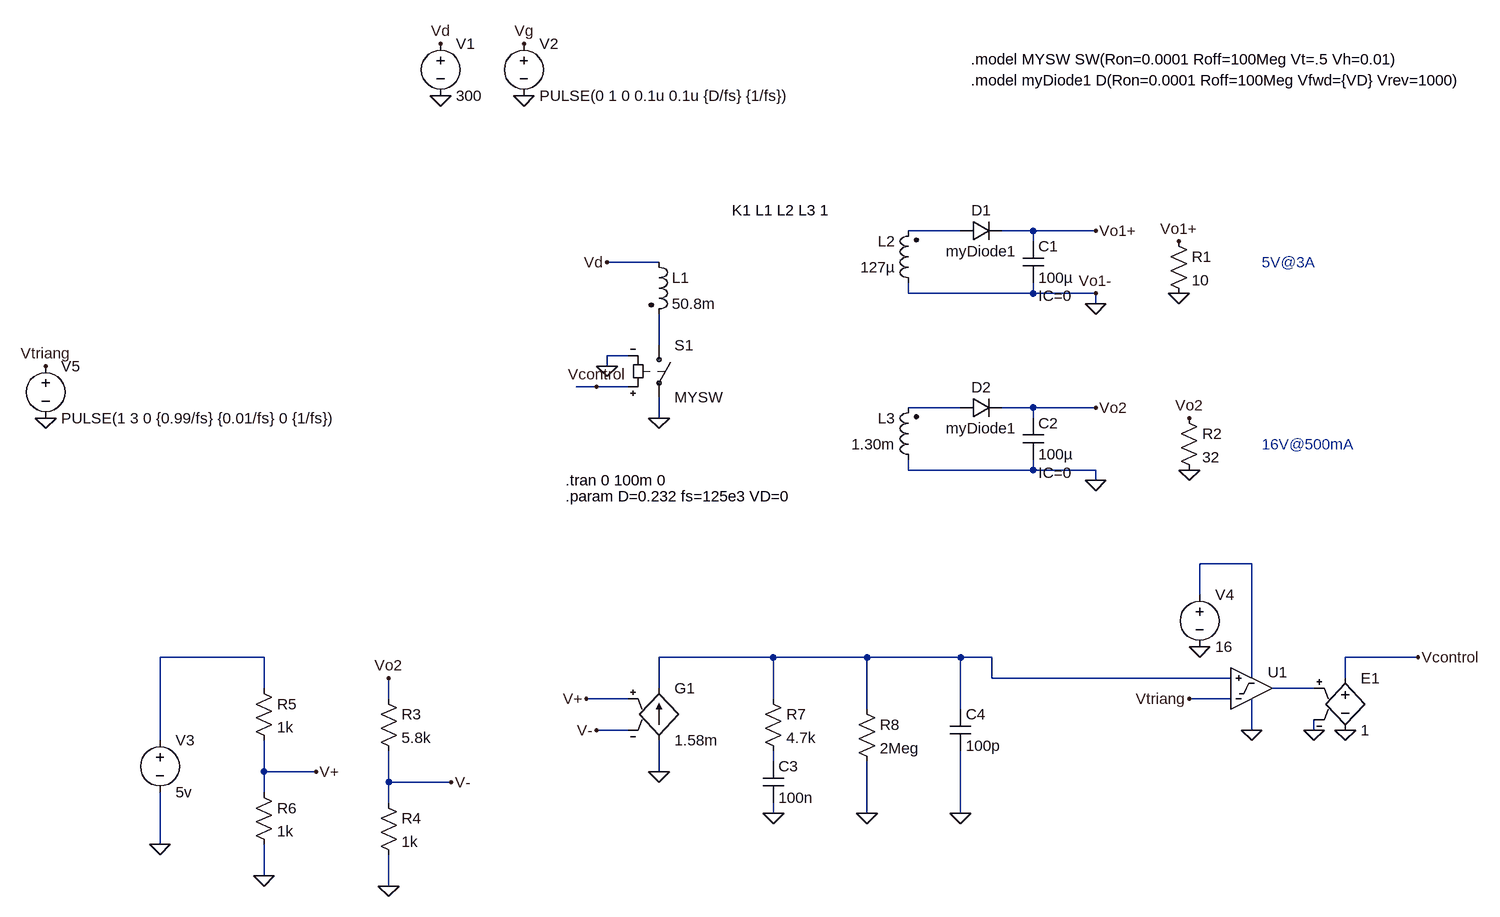
[diagram p0: schematic full_ideal.asc]
full_ideal.asc, the LTspice schematic file:
Version 4
SHEET 1 1952 1124
WIRE 704 96 624 96
WIRE 816 96 768 96
WIRE 912 96 816 96
WIRE 816 112 816 96
WIRE 240 144 160 144
WIRE 624 192 624 176
WIRE 816 192 816 176
WIRE 816 192 624 192
WIRE 912 192 816 192
WIRE 912 208 912 192
WIRE 240 272 240 224
WIRE 192 288 160 288
WIRE 160 304 160 288
WIRE 144 336 112 336
WIRE 192 336 144 336
WIRE 704 368 624 368
WIRE 816 368 768 368
WIRE 912 368 816 368
WIRE 240 384 240 352
WIRE 816 384 816 368
WIRE 624 464 624 448
WIRE 816 464 816 448
WIRE 816 464 624 464
WIRE 912 464 816 464
WIRE 912 480 912 464
WIRE 1152 608 1072 608
WIRE 1072 656 1072 608
WIRE -368 752 -528 752
WIRE 416 752 240 752
WIRE 560 752 416 752
WIRE 704 752 560 752
WIRE 752 752 704 752
WIRE 1408 752 1296 752
WIRE 752 784 752 752
WIRE 1120 784 752 784
WIRE 1152 784 1152 608
WIRE 1296 784 1296 752
WIRE -368 800 -368 752
WIRE 240 800 240 752
WIRE 1248 800 1184 800
WIRE -176 816 -176 784
WIRE 192 816 128 816
WIRE 416 816 416 752
WIRE 1120 816 1056 816
WIRE 560 832 560 752
WIRE 704 832 704 752
WIRE 192 864 144 864
WIRE 1152 864 1152 816
WIRE 1248 864 1248 848
WIRE -528 880 -528 752
WIRE 416 912 416 896
WIRE -368 928 -368 880
WIRE -288 928 -368 928
WIRE 240 928 240 880
WIRE -176 944 -176 896
WIRE -80 944 -176 944
WIRE -368 960 -368 928
WIRE -176 976 -176 944
WIRE 416 992 416 976
WIRE 560 992 560 912
WIRE 704 992 704 896
WIRE -528 1040 -528 960
WIRE -368 1088 -368 1040
WIRE -176 1104 -176 1056
FLAG 240 384 0
FLAG -96 -112 0
FLAG -96 -192 Vd
FLAG 160 144 Vd
FLAG 912 96 Vo1+
FLAG 32 -112 0
FLAG 32 -192 Vg
FLAG 912 368 Vo2
FLAG 912 480 0
FLAG 912 192 Vo1-
FLAG 160 304 0
FLAG 912 208 0
FLAG 1040 112 Vo1+
FLAG 1040 192 0
FLAG 1056 384 Vo2
FLAG 1056 464 0
FLAG -176 1104 0
FLAG -176 784 Vo2
FLAG -80 944 V-
FLAG 144 864 V-
FLAG -368 1088 0
FLAG -528 1040 0
FLAG -288 928 V+
FLAG 128 816 V+
FLAG 240 928 0
FLAG 416 992 0
FLAG 560 992 0
FLAG 704 992 0
FLAG 1056 816 Vtriang
FLAG 1152 864 0
FLAG 1072 736 0
FLAG 1248 864 0
FLAG 1296 864 0
FLAG 1408 752 Vcontrol
FLAG -704 384 0
FLAG -704 304 Vtriang
FLAG 144 336 Vcontrol
SYMBOL ind2 640 192 R180
WINDOW 0 36 80 Left 2
WINDOW 3 36 40 Left 2
SYMATTR InstName L2
SYMATTR Value 127µ
SYMATTR Type ind
SYMBOL ind2 224 128 R0
SYMATTR InstName L1
SYMATTR Value 50.8m
SYMATTR Type ind
SYMBOL voltage -96 -208 R0
WINDOW 123 0 0 Left 0
WINDOW 39 0 0 Left 0
SYMATTR InstName V1
SYMATTR Value 300
SYMBOL voltage 32 -208 R0
WINDOW 123 0 0 Left 0
WINDOW 39 0 0 Left 0
SYMATTR InstName V2
SYMATTR Value PULSE(0 1 0 0.1u 0.1u {D/fs} {1/fs})
SYMBOL ind2 640 464 R180
WINDOW 0 36 80 Left 2
WINDOW 3 36 40 Left 2
SYMATTR InstName L3
SYMATTR Value 1.30m
SYMATTR Type ind
SYMBOL sw 240 256 R0
SYMATTR InstName S1
SYMATTR Value MYSW
SYMBOL diode 704 112 R270
WINDOW 0 32 32 VTop 2
WINDOW 3 0 32 VBottom 2
SYMATTR InstName D1
SYMATTR Value myDiode1
SYMBOL diode 704 384 R270
WINDOW 0 32 32 VTop 2
WINDOW 3 0 32 VBottom 2
SYMATTR InstName D2
SYMATTR Value myDiode1
SYMBOL cap 800 112 R0
WINDOW 123 24 84 Left 2
SYMATTR Value2 IC=0
SYMATTR InstName C1
SYMATTR Value 100µ
SYMBOL cap 800 384 R0
WINDOW 123 24 84 Left 2
SYMATTR Value2 IC=0
SYMATTR InstName C2
SYMATTR Value 100µ
SYMBOL res 1024 96 R0
SYMATTR InstName R1
SYMATTR Value 10
SYMBOL res 1040 368 R0
SYMATTR InstName R2
SYMATTR Value 32
SYMBOL g 240 784 R0
SYMATTR InstName G1
SYMATTR Value 1.58m
SYMBOL res -192 800 R0
SYMATTR InstName R3
SYMATTR Value 5.8k
SYMBOL res -192 960 R0
SYMATTR InstName R4
SYMATTR Value 1k
SYMBOL voltage -528 864 R0
SYMATTR InstName V3
SYMATTR Value 5v
SYMBOL res -384 784 R0
SYMATTR InstName R5
SYMATTR Value 1k
SYMBOL res -384 944 R0
SYMATTR InstName R6
SYMATTR Value 1k
SYMBOL res 400 800 R0
SYMATTR InstName R7
SYMATTR Value 4.7k
SYMBOL cap 400 912 R0
SYMATTR InstName C3
SYMATTR Value 100n
SYMBOL res 544 816 R0
SYMATTR InstName R8
SYMATTR Value 2Meg
SYMBOL cap 688 832 R0
SYMATTR InstName C4
SYMATTR Value 100p
SYMBOL voltage 1072 640 R0
WINDOW 123 0 0 Left 0
WINDOW 39 0 0 Left 0
SYMATTR InstName V4
SYMATTR Value 16
SYMBOL e 1296 768 R0
SYMATTR InstName E1
SYMATTR Value 1
SYMBOL MyComparator 1152 800 R0
SYMATTR InstName U1
SYMBOL voltage -704 288 R0
WINDOW 123 0 0 Left 0
WINDOW 39 0 0 Left 0
SYMATTR InstName V5
SYMATTR Value PULSE(1 3 0 {0.99/fs} {0.01/fs} 0 {1/fs})
TEXT 352 64 Left 2 !K1 L1 L2 L3 1
TEXT 96 480 Left 2 !.tran 0 100m 0
TEXT 96 504 Left 2 !.param D=0.232 fs=125e3 VD=0
TEXT 720 -168 Left 2 !.model MYSW SW(Ron=0.0001 Roff=100Meg Vt=.5 Vh=0.01)
TEXT 720 -136 Left 2 !.model myDiode1 D(Ron=0.0001 Roff=100Meg Vfwd={VD} Vrev=1000)
TEXT 1168 144 Left 2 ;5V@3A
TEXT 1168 424 Left 2 ;16V@500mA

The netlist it stands for:
* full_ideal.asc
L2 0 N001 127µ
L1 Vd N002 50.8m
V1 Vd 0 300
V2 Vg 0 PULSE(0 1 0 0.1u 0.1u {D/fs} {1/fs})
L3 0 N003 1.30m
S1 N002 0 Vcontrol 0 MYSW
D1 N001 Vo1+ myDiode1
D2 N003 Vo2 myDiode1
C1 Vo1+ 0 100µ IC=0
C2 Vo2 0 100µ IC=0
R1 Vo1+ 0 10
R2 Vo2 0 32
G1 0 N006 V+ V- 1.58m
R3 Vo2 V- 5.8k
R4 V- 0 1k
V3 N005 0 5v
R5 N005 V+ 1k
R6 V+ 0 1k
R7 N006 N008 4.7k
C3 N008 0 100n
R8 N006 0 2Meg
C4 N006 0 100p
V4 N004 0 16
E1 Vcontrol 0 N007 0 1
XU1 N006 Vtriang N004 0 N007 MyComparator  ; pins in+ in- pos neg out
V5 Vtriang 0 PULSE(1 3 0 {0.99/fs} {0.01/fs} 0 {1/fs})
.model D D
.lib standard.dio
K1 L1 L2 L3 1
.tran 0 100m 0
.param D=0.232 fs=125e3 VD=0
.model MYSW SW(Ron=0.0001 Roff=100Meg Vt=.5 Vh=0.01)
.model myDiode1 D(Ron=0.0001 Roff=100Meg Vfwd={VD} Vrev=1000)
* 5V@3A
* 16V@500mA
.lib MyComparator.sub
.backanno
.end